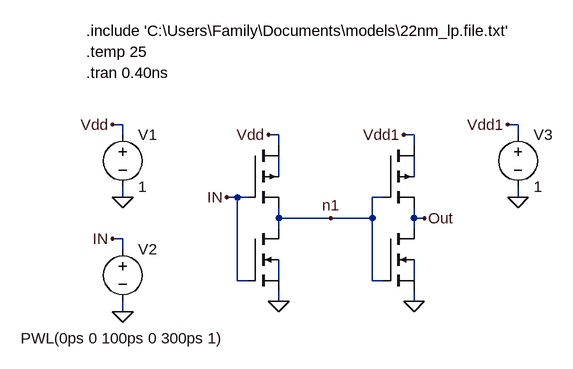
[diagram p0: schematic HW3_q2a.asc]
HW3_q2a.asc, the LTspice schematic file:
Version 4
SHEET 1 880 680
WIRE -32 16 -48 16
WIRE 576 16 560 16
WIRE -32 32 -32 16
WIRE 208 32 192 32
WIRE 416 32 400 32
WIRE 576 32 576 16
WIRE 208 48 208 32
WIRE 416 48 416 32
WIRE 208 96 208 64
WIRE 416 96 416 64
WIRE -32 128 -32 112
WIRE 144 128 128 128
WIRE 160 128 144 128
WIRE 368 128 352 128
WIRE 576 128 576 112
WIRE 208 160 208 144
WIRE 288 160 208 160
WIRE 352 160 352 128
WIRE 352 160 288 160
WIRE 416 160 416 144
WIRE 432 160 416 160
WIRE 208 176 208 160
WIRE 416 176 416 160
WIRE -32 192 -48 192
WIRE -32 208 -32 192
WIRE 144 256 144 128
WIRE 160 256 144 256
WIRE 208 256 208 224
WIRE 352 256 352 160
WIRE 368 256 352 256
WIRE 416 256 416 224
WIRE 208 288 208 272
WIRE 416 288 416 272
WIRE -32 304 -32 288
FLAG 208 288 0
FLAG -48 16 Vdd
FLAG -48 192 IN
FLAG 192 32 Vdd
FLAG -32 128 0
FLAG -32 304 0
FLAG 128 128 IN
FLAG 416 288 0
FLAG 400 32 Vdd1
FLAG 432 160 Out
FLAG 560 16 Vdd1
FLAG 576 128 0
FLAG 288 160 n1
SYMBOL nmos4 160 176 R0
WINDOW 0 56 32 Invisible 2
WINDOW 3 56 72 Invisible 2
SYMATTR InstName M1
SYMATTR Value2 l=0.03u w=0.4u
SYMBOL pmos4 160 48 R0
WINDOW 0 56 32 Invisible 2
WINDOW 3 56 72 Invisible 2
SYMATTR InstName M2
SYMATTR Value2 l=0.03u w=0.7u
SYMBOL voltage -32 16 R0
WINDOW 123 0 0 Left 2
WINDOW 39 0 0 Left 2
SYMATTR InstName V1
SYMATTR Value 1
SYMBOL voltage -32 192 R0
WINDOW 3 -157 153 Left 2
WINDOW 123 0 0 Left 2
WINDOW 39 0 0 Left 2
SYMATTR Value PWL(0ps 0 100ps 0 300ps 1)
SYMATTR InstName V2
SYMBOL nmos4 368 176 R0
WINDOW 0 56 32 Invisible 2
WINDOW 3 56 72 Invisible 2
SYMATTR InstName M3
SYMATTR Value2 l=0.03u w=0.4u
SYMBOL pmos4 368 48 R0
WINDOW 0 56 32 Invisible 2
WINDOW 3 56 72 Invisible 2
SYMATTR InstName M4
SYMATTR Value2 l=0.03u w=0.7u
SYMBOL voltage 576 16 R0
WINDOW 123 0 0 Left 2
WINDOW 39 0 0 Left 2
SYMATTR InstName V3
SYMATTR Value 1
TEXT -88 -64 Left 2 !.tran 0.40ns
TEXT -88 -128 Left 2 !.include 'C:\\Users\\Family\\Documents\\models\\22nm_lp.file.txt'
TEXT -88 -96 Left 2 !.temp 25

The netlist it stands for:
* HW3_q2a.asc
M1 n1 IN 0 N003 NMOS l=0.03u w=0.4u
M2 Vdd IN n1 N001 PMOS l=0.03u w=0.7u
V1 Vdd 0 1
V2 IN 0 PWL(0ps 0 100ps 0 300ps 1)
M3 Out n1 0 N004 NMOS l=0.03u w=0.4u
M4 Vdd1 n1 Out N002 PMOS l=0.03u w=0.7u
V3 Vdd1 0 1
.model NMOS NMOS
.model PMOS PMOS
.lib standard.mos
.tran 0.40ns
.include 'C:\Users\Family\Documents\models\22nm_lp.file.txt'
.temp 25
.backanno
.end